# EAGLE schematic Helder ll - Placa Redundante.V2_ (EAGLE 9.7.0)
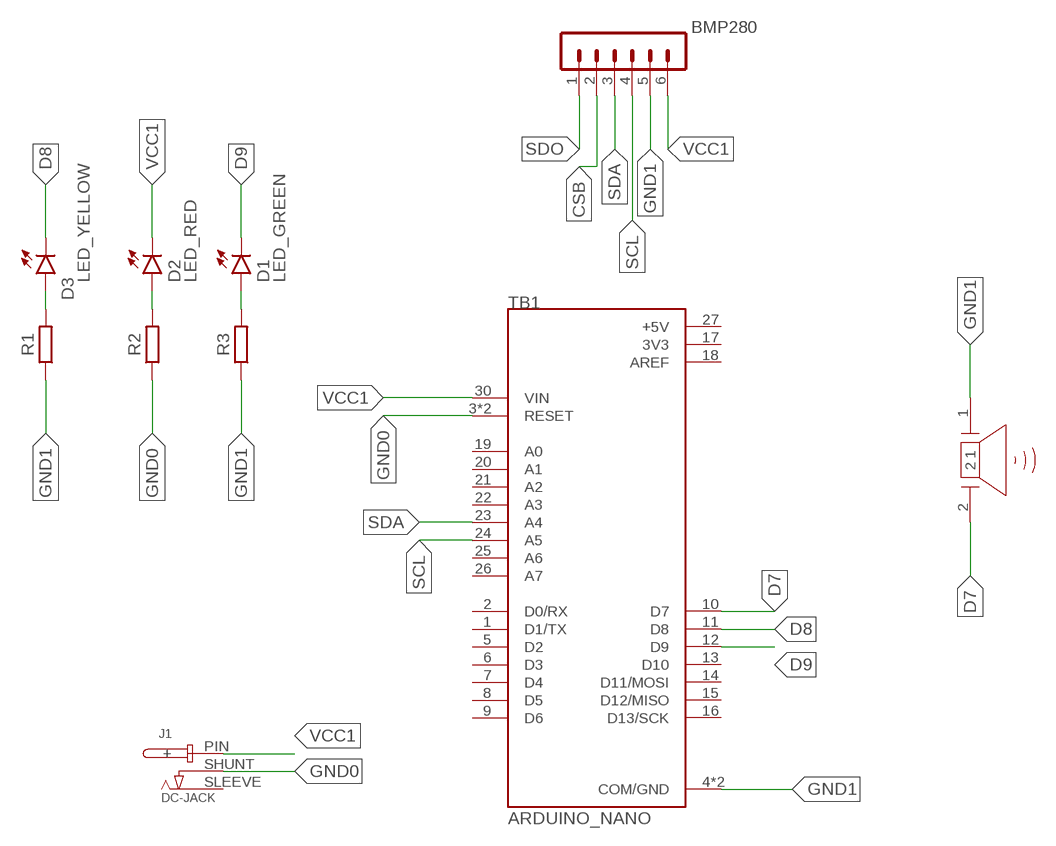
[diagram p0: schematic, sheet 1]

## Parts
BMP280  MA06-1  [MA06-1]
D1  LED_GREEN  LED_RADIAL_GREEN  [LEDRD254W60D565H860B_G]
D2  LED_RED  LED_RADIAL_RED  [LEDRD254W60D565H860B]
D3  LED_YELLOW  LED_RADIAL_YELLOW  [LEDRD254W60D565H860B_Y]
J1  DC-JACK  RASM722  [RASM722X]
LS1  PIEZO  [PIEZO]
R1  R_AXIAL-7.2MM-PITCH  [RESAD724W46L381D178B]
R2  R_AXIAL-7.2MM-PITCH  [RESAD724W46L381D178B]
R3  R_AXIAL-7.2MM-PITCH  [RESAD724W46L381D178B]
TB1  ARDUINO_NANO  [SHIELD_ARDUINO_NANO]

## Nets
CSB: BMP280.2
D7: LS1.2 TB1.10(D7)
D8: D3.2(C) TB1.11(D8)
D9: D1.2(C) TB1.12(D9)
GND0: J1.SHUNT(-) R2.1 TB1.3(RESET) TB1.28(RESET)
GND1: BMP280.5 LS1.1 R1.1 R3.1 TB1.4(COM/GND) TB1.29(COM/GND)
N$1: D1.1(A) R3.2
N$2: D2.1(A) R2.2
N$3: D3.1(A) R1.2
SCL: BMP280.4 TB1.24(A5)
SDA: BMP280.3 TB1.23(A4)
SDO: BMP280.1
VCC1: BMP280.6 D2.2(C) J1.PIN(+) TB1.30(VIN)
Unconnected: J1.SLEEVE(NEG) TB1.1(D1/TX) TB1.2(D0/RX) TB1.5(D2) TB1.6(D3) TB1.7(D4) TB1.8(D5) TB1.9(D6) TB1.13(D10) TB1.14(D11/MOSI) TB1.15(D12/MISO) TB1.16(D13/SCK) TB1.19(A0) TB1.20(A1) TB1.21(A2) TB1.22(A3) TB1.25(A6) TB1.26(A7)

## Power pins joined to a net without a drawn wire
3V3: TB1.17(3V3)
+5V: TB1.27(+5V)
AREF: TB1.18(AREF)

## Library data of the parts
BMP280 = con-lstb:MA06-1: PIN HEADER; OC_FARNELL: unknown; OC_NEWARK: unknown
D1-D3 = Tinkercad:LED_RADIAL: LED - Generic; CATEGORY: Opto-Electronic; SUB-CATEGORY: LED
J1 = Connector:RASM722: CONN PWR JACK 2.1X5.5MM SOLDER Manufacturer's datasheet <http://www.switchcraft.com/Documents/EDG4.pdf#page=135>; CATEGORY: DC Power Connectors; DESCRIPTION: DC Power Connectors 2MM R/A SMT JK; MANUFACTURER: Switchcraft Inc.; MPN: RASM722X; OPERATING_TEMPERATURE: -; PART_STATUS: Active; PITCH: -; ROHS_COMPLIANCE: ROHS3 Compliant; SERIES: RASM72; SUB-CATEGORY: Power Connectors; TYPE: Jack, Male, Surface Mount, Right Angle
LS1 = Tinkercad:PIEZO: Piezoelectric Sounders / Buzzers Reference Datasheet <https://www.murata.com/products/productdata/8801054621726/SPEC-PKM17EPPH4001-B0.pdf?1517839212000>
R1-R3 = Resistor:R: Resistor Fixed - Generic; CATEGORY: Resistor; SUB-CATEGORY: Fixed
TB1 = ARDUINO_NANO:ARDUINO_NANO: Arduino Nano, Through Hole Check availability <https://pricing.snapeda.com/parts/Arduino%20Nano/Arduino/view-part?ref=eda>; AVAILABILITY: Not in stock; CHECK_PRICES: https://www.snapeda.com/parts/Arduino%20Nano/Arduino/view-part/?ref=eda; DESCRIPTION: Small, complete, and breadboard-friendly board based on the ATmega328 (Arduino Nano 3.x); MF: Arduino; MP: Arduino Nano; PACKAGE: Non-Standard Arduino; PRICE: None; SNAPEDA_LINK: https://www.snapeda.com/parts/Arduino%20Nano/Arduino/view-part/?ref=snap